# EAGLE design notre_carte (EAGLE 7.7.0)
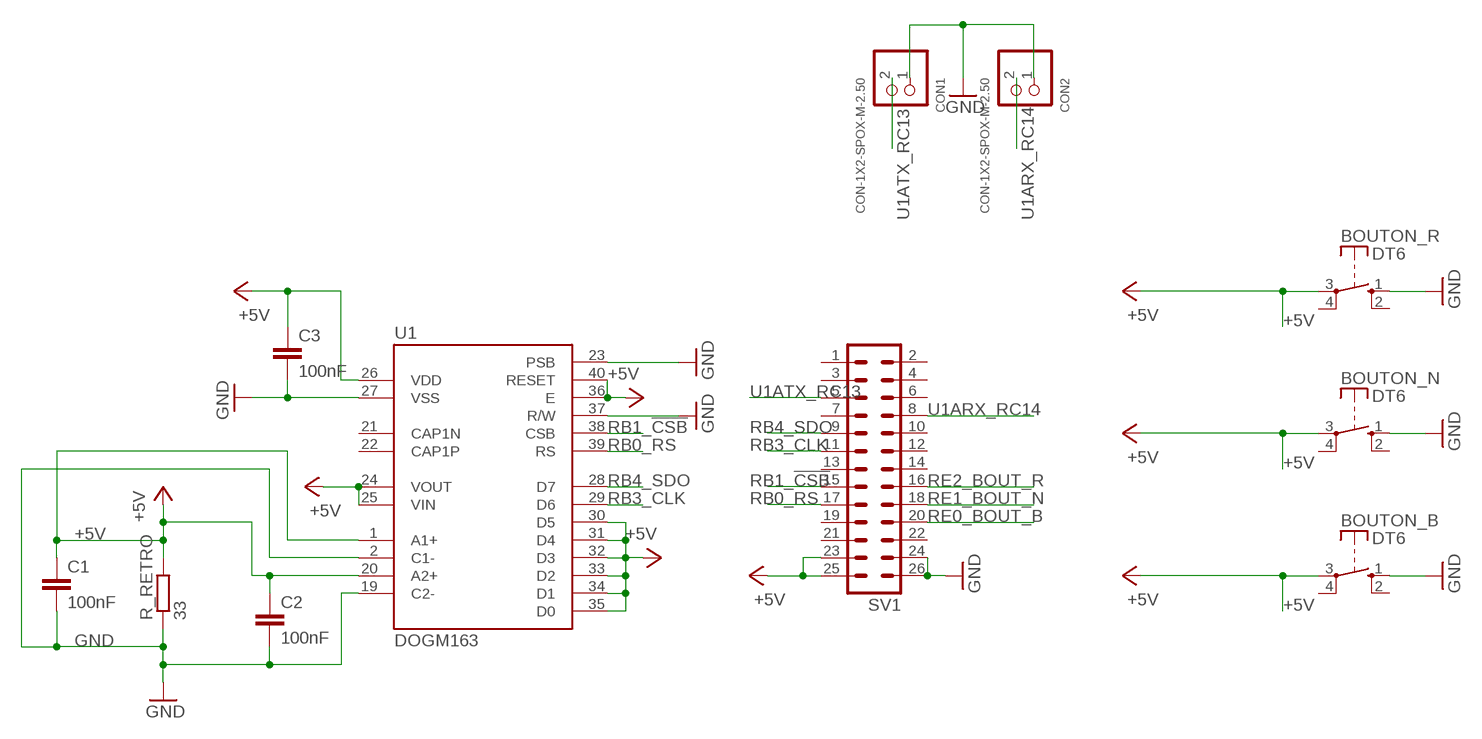
[diagram p0: schematic, sheet 1]

## Parts
BOUTON_B  DT6  [DT6]
BOUTON_N  DT6  [DT6]
BOUTON_R  DT6  [DT6]
C1  100nF  C-EU025-025X050  [C025-025X050]
C2  100nF  C-EU025-025X050  [C025-025X050]
C3  100nF  C-EU025-025X050  [C025-025X050]
CON1  CON-1X2-SPOX-M-2.50  [SPOX-M-2.50-02]
CON2  CON-1X2-SPOX-M-2.50  [SPOX-M-2.50-02]
R_RETRO  33  R-EU_0207/15  [0207/15]
SV1  ML26  [ML26]
U1  DOGM163  [DOGM]

## Nets
+5V: BOUTON_B.3(P) BOUTON_N.3(P) BOUTON_R.3(P) C1.1 C2.1 C3.1 R_RETRO.2 SV1.23 SV1.25 U1.1(A1+) U1.20(A2+) U1.24(VOUT) U1.25(VIN) U1.26(VDD) U1.30(D5) U1.31(D4) U1.32(D3) U1.33(D2) U1.34(D1) U1.35(D0) U1.36(E) U1.40(RESET)
GND: BOUTON_B.1(S) BOUTON_N.1(S) BOUTON_R.1(S) C1.2 C2.2 C3.2 CON1.1 CON2.1 R_RETRO.1 SV1.24 SV1.26 U1.2(C1-) U1.19(C2-) U1.23(PSB) U1.27(VSS) U1.37(R/W)
RB0_RS: SV1.17 U1.39(RS)
RB1_!CSB: SV1.15 U1.38(CSB)
RB3_CLK: SV1.11 U1.29(D6)
RB4_SDO: SV1.9 U1.28(D7)
RE0_BOUT_B: SV1.20
RE1_BOUT_N: SV1.18
RE2_BOUT_R: SV1.16
U1ARX_RC14: CON2.2 SV1.8
U1ATX_RC13: CON1.2 SV1.5
Unconnected: BOUTON_B.2(S) BOUTON_B.4(P) BOUTON_N.2(S) BOUTON_N.4(P) BOUTON_R.2(S) BOUTON_R.4(P) SV1.1 SV1.2 SV1.3 SV1.4 SV1.6 SV1.7 SV1.10 SV1.12 SV1.13 SV1.14 SV1.19 SV1.21 SV1.22 U1.21(CAP1N) U1.22(CAP1P)

## Library data of the parts
BOUTON_B BOUTON_N BOUTON_R = switch-misc:DT: ITT SWITCH
C1-C3 = rcl:C-EU: CAPACITOR, European symbol
CON1 CON2 = EEA0601-770-20230201:CON-1X2: Fabricant : MOLEX 22-03-5025 <http://www.molex.com/molex/products/datasheet.jsp?part=active/0022035025_PCB_HEADERS.xml> Connecteur fil-à-carte, 2.5 mm, 2 Contact(s), Embase, Série SPOX 5267, Traversant, 1 Rangée(s) Distributeurs : RS : 687-8045 <http://fr.rs-online.com/web/p/embases-de-circuit-imprime/6878045/?sra=pstk> Farnell : 9979611 <http://fr.farnell.com/molex/22-03-5025/boitier-vertical-2-5mm-2voies/dp/9979611>
R_RETRO = rcl:R-EU_: RESISTOR, European symbol
SV1 = EEA0601-770-20170216:ML26: HARTING; OC_FARNELL: unknown; OC_NEWARK: unknown
U1 = EEA0601-770-20170216:DOGM163

## Board
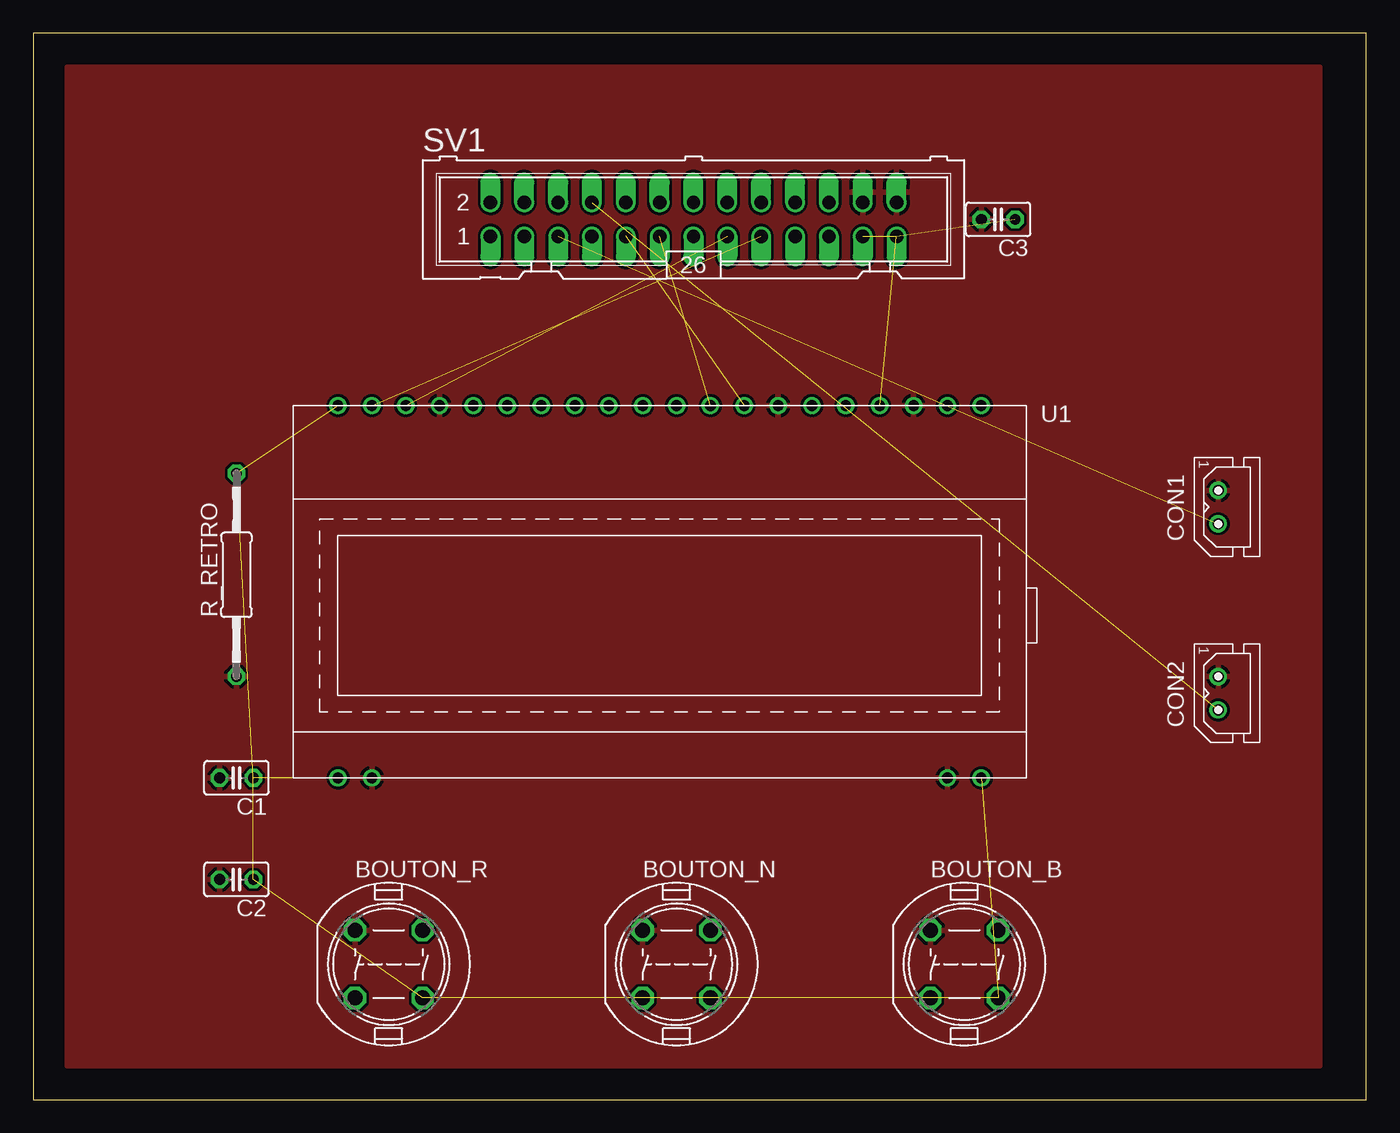
[diagram p1: board, top side]

Size 100 x 80 mm. Coordinates in mm from the lower left corner, seen from the top.
Outline: 0,0 100,0 100,80 0,80 0,0
Copper layers (1*16): Top 0.035mm / dielectric 1.5mm / Bottom 0.035mm
Design rules "default": minimum track width 10mil, minimum drill 24mil, track to track 8mil, track to pad 8mil, pad to pad 8mil, via to via 8mil, smd to smd 8mil, copper to edge 40mil, drill to drill 8mil, minimum pad ring 10mil, minimum via ring 8mil, stop-mask expansion 4mil, vias tented up to drill 0mil, thermal gap 10mil

### Footprints (pad centres in the part's own frame; a part is rotated, then mirrored left to right if it is on the bottom)
DT6 = drill 1.118 octagon: 1 -2.54,2.54; 2 2.54,2.54; 3 2.54,-2.54; 4 -2.54,-2.54
C025-025X050 = drill 0.813 octagon: 1 -1.27,0; 2 1.27,0
SPOX-M-2.50-02 = drill 0.8: 1 1.25,0; 2 -1.25,0
0207/15 = drill 0.813 octagon: 1 -7.62,0; 2 7.62,0
ML26 = drill 1 offset: 1 -15.24,-1.27; 2 -15.24,1.27; 3 -12.7,-1.27; 4 -12.7,1.27; 5 -10.16,-1.27; 6 -10.16,1.27; 7 -7.62,-1.27; 8 -7.62,1.27; 9 -5.08,-1.27; 10 -5.08,1.27; 11 -2.54,-1.27; 12 -2.54,1.27; 13 0,-1.27; 14 0,1.27; 15 2.54,-1.27; 16 2.54,1.27; 17 5.08,-1.27; 18 5.08,1.27; 19 7.62,-1.27; 20 7.62,1.27; 21 10.16,-1.27; 22 10.16,1.27; 23 12.7,-1.27; 24 12.7,1.27; 25 15.24,-1.27; 26 15.24,1.27
DOGM = drill 0.8: 1 -24.13,-12.7; 2 -21.59,-12.7; 19 21.59,-12.7; 20 24.13,-12.7; 21 24.13,15.24; 22 21.59,15.24; 23 19.05,15.24; 24 16.51,15.24; 25 13.97,15.24; 26 11.43,15.24; 27 8.89,15.24; 28 6.35,15.24; 29 3.81,15.24; 30 1.27,15.24; 31 -1.27,15.24; 32 -3.81,15.24; 33 -6.35,15.24; 34 -8.89,15.24; 35 -11.43,15.24; 36 -13.97,15.24; 37 -16.51,15.24; 38 -19.05,15.24; 39 -21.59,15.24; 40 -24.13,15.24

### Placement (x,y rotation side)
BOUTON_B  69.85,10.16 0 top
BOUTON_N  48.26,10.16 0 top
BOUTON_R  26.67,10.16 0 top
C1  15.24,24.13 180 top
C2  15.24,16.51 180 top
C3  72.39,66.04 180 top
CON1  88.9,44.45 90 top
CON2  88.9,30.48 90 top
R_RETRO  15.24,39.37 90 top
SV1  49.53,66.04 0 top
U1  46.99,36.83 0 top

### Tracks (layer width: path | path; a pad name or v marks a point on that pad's centre or on a via)
+5V  (21 unrouted)
GND
  pour Top: 2.54,77.47 96.52,77.47 96.52,2.54 2.54,2.54
RB0_RS  (1 unrouted)
RB1_!CSB  (1 unrouted)
RB3_CLK  (1 unrouted)
RB4_SDO  (1 unrouted)
U1ARX_RC14  (1 unrouted)
U1ATX_RC13  (1 unrouted)